# Altium project Plata_3(HFF).PrjPcb
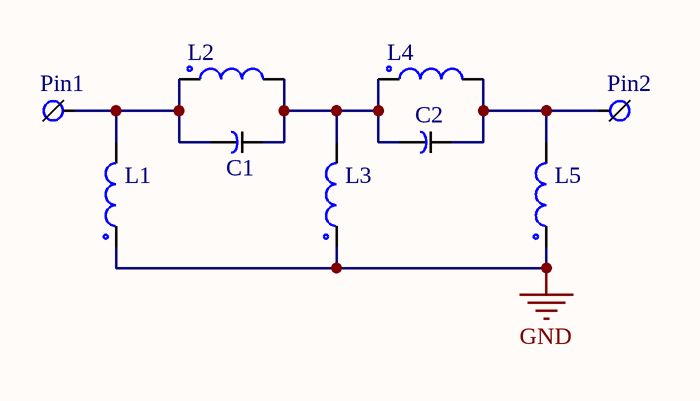
[diagram p0: Sheet3.SchDoc]
1 sheet, 9 parts. Net scope: global (net labels, ports and power ports of the same name join across sheets).
Board file: Plata_3.PcbDoc

## Sheet Sheet3.SchDoc
size A4

### Parts
C1  C1  [C1]  (value not drawn)
C2  C2  [C2]  (value not drawn)
L1  L1,L5  [L1,L5]  (value not drawn)
L2  L2,L4  [L2,L4]  (value not drawn)
L3  L3  [L3]  (value not drawn)
L4  L2,L4  [L2,L4]  (value not drawn)
L5  L1,L5  [L1,L5]  (value not drawn)
Pin1  Pin  [Pin]  (value not drawn)
Pin2  Pin  [Pin]  (value not drawn)

### Nets
GND: L1.1 L3.1 L5.1
NetC1_1: C1.1 L1.2 L2.1 Pin1.1
NetC1_2: C1.2 C2.1 L2.2 L3.2 L4.1
NetC2_2: C2.2 L4.2 L5.2 Pin2.1